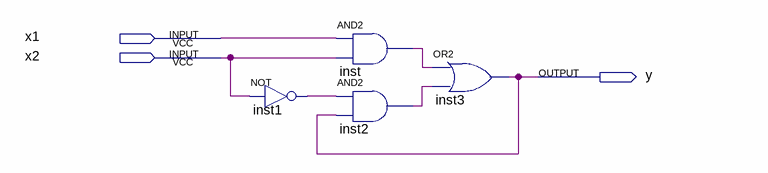
[diagram p0: schematic sheet]
// Quartus schematic Q1a.bdf as structural Verilog: 4 symbols, 3 pins
module Q1a (
  input  x1,
  input  x2,
  output y
);

  wire inst1_out, inst2_out, inst_out;

  not inst1 (inst1_out, x2);
  and inst (inst_out, x1, x2);
  and inst2 (inst2_out, inst1_out, y);
  or inst3 (y, inst_out, inst2_out);
endmodule
